# EAGLE design Swill REV A1 (EAGLE 7.3.0)
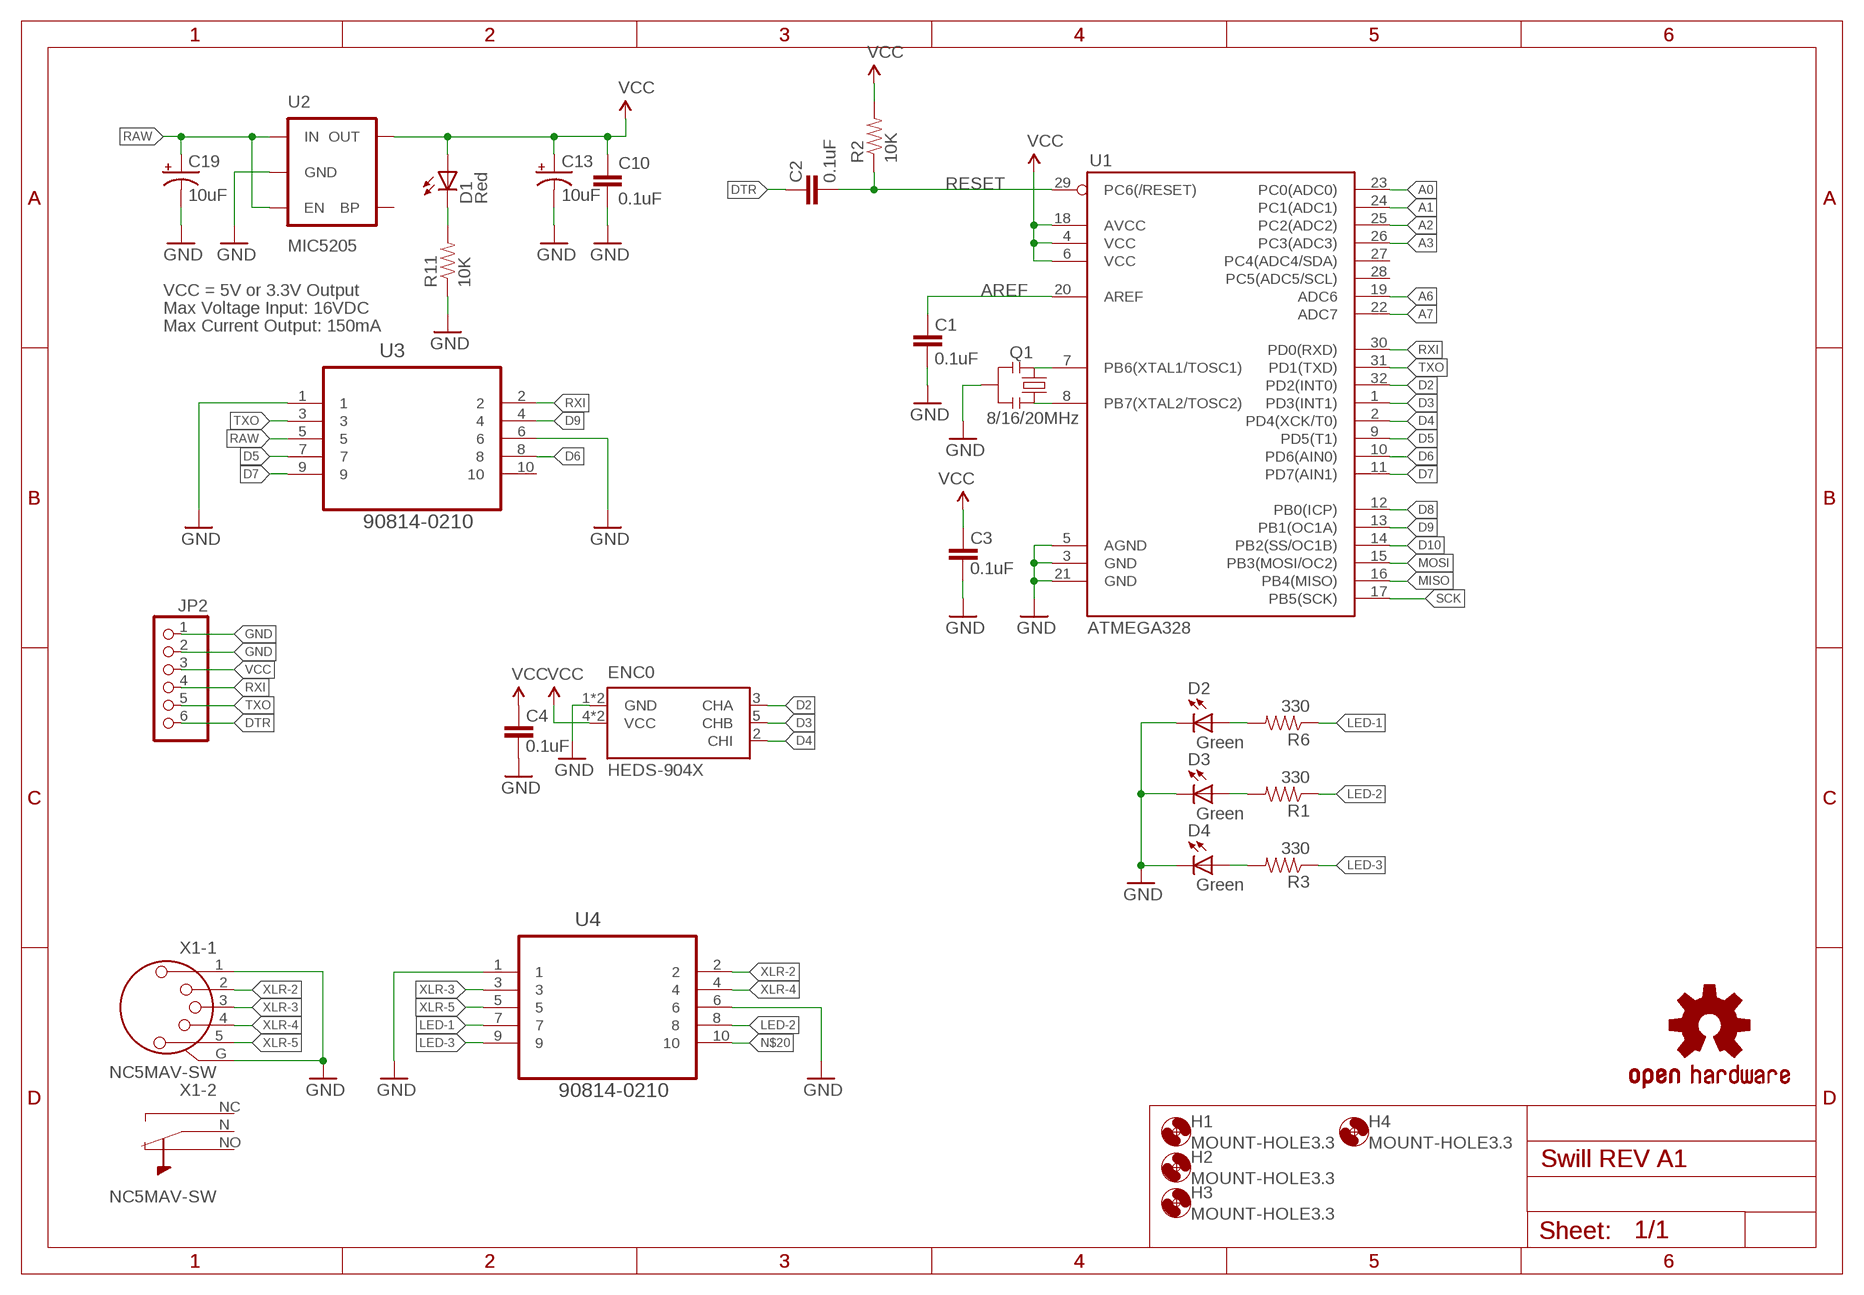
[diagram p0: schematic, sheet 1]

## Parts
C1  0.1uF  CAP0603-CAP  [0603-CAP]
C2  0.1uF  CAP0603-CAP  [0603-CAP]
C3  0.1uF  CAP0603-CAP  [0603-CAP]
C4  0.1uF  CAP0603-CAP  [0603-CAP]
C10  0.1uF  CAP0603-CAP  [0603-CAP]
C13  10uF  CAP_POL1206  [EIA3216]
C19  10uF  CAP_POL1206  [EIA3216]
D1  Red  LED  [0603-LED-ALT1]
D2  Green  LED  [0603-LED-ALT1]
D3  Green  LED  [0603-LED-ALT1]
D4  Green  LED  [0603-LED-ALT1]
ENC0  HEDS-904X  [HEDS-9041]
H1  MOUNT-HOLE3.3  [3,3]
H2  MOUNT-HOLE3.3  [3,3]
H3  MOUNT-HOLE3.3  [3,3]
H4  MOUNT-HOLE3.3  [3,3]
JP2  PINHD-1X6  [1X06]
Q1  8/16/20MHz  RESONATOR1:1  [RESONATOR-SMD-1:1]
R1  330  RESISTOR0603-RES  [0603-RES]
R2  10K  RESISTOR0603-RES  [0603-RES]
R3  330  RESISTOR0603-RES  [0603-RES]
R6  330  RESISTOR0603-RES  [0603-RES]
R11  10K  RESISTOR0603-RES  [0603-RES]
U1  ATMEGA328  ATMEGA168  [TQFP32-08]
U2  MIC5205  V_REG_LDOSMD  [SOT23-5]
U3  90814-0210  [MOLEX_90814-0210]
U4  90814-0210  [MOLEX_90814-0210]
U$3  OSHW-LOGOS  [OSHW-LOGO-S]
X1  NC5MAV-SW  [NC5MAV-SW]

## Nets
3.3V: C4.2 ; supply symbol labelled VCC
A0: U1.23(PC0(ADC0))
A1: U1.24(PC1(ADC1))
A2: U1.25(PC2(ADC2))
A3: U1.26(PC3(ADC3))
A6: U1.19(ADC6)
A7: U1.22(ADC7)
AREF: C1.2 U1.20(AREF)
D2: ENC0.3(CHA) U1.32(PD2(INT0))
D3: ENC0.5(CHB) U1.1(PD3(INT1))
D4: ENC0.2(CHI) U1.2(PD4(XCK/T0))
D5: U1.9(PD5(T1)) U3.7
D6: U1.10(PD6(AIN0)) U3.8
D7: U1.11(PD7(AIN1)) U3.9
D8: U1.12(PB0(ICP))
D9: U1.13(PB1(OC1A)) U3.4
D10: U1.14(PB2(SS/OC1B))
DTR: C2.2 JP2.6
GND [vcc]: C1.1 C3.1 C4.1 C10.2 C13.C(-) C19.C(-) D2.C D3.C D4.C ENC0.1(GND) ENC0.A(GND) JP2.1 JP2.2 Q1.2 R11.1 U1.3(GND) U1.5(AGND) U1.21(GND) U2.2(GND) U3.1 U3.6 U4.1 U4.6 X1.1 X1.G(-1:G)
LED-1: R6.1 U4.7
LED-2: R1.1 U4.8
LED-3: R3.1 U4.9
MISO: U1.16(PB4(MISO))
MOSI: U1.15(PB3(MOSI/OC2))
N$1: Q1.3 U1.8(PB7(XTAL2/TOSC2))
N$2: Q1.1 U1.7(PB6(XTAL1/TOSC1))
N$3: D3.A R1.2
N$4: D1.C R11.2
N$5: D4.A R3.2
N$7: D2.A R6.2
N$20: U4.10
RAW [vcc]: C19.A(+) U2.1(IN) U2.3(EN) U3.5
RESET: C2.1 R2.1 U1.29(PC6(/RESET))
RXI: JP2.4 U1.30(PD0(RXD)) U3.2
SCK: U1.17(PB5(SCK))
TXO: JP2.5 U1.31(PD1(TXD)) U3.3
VCC: C3.2 C10.1 C13.A(+) D1.A ENC0.4(VCC) ENC0.B(VCC) JP2.3 R2.2 U1.4(VCC) U1.6(VCC) U1.18(AVCC) U2.5(OUT)
XLR-2: U4.2 X1.2
XLR-3: U4.3 X1.3
XLR-4: U4.4 X1.4
XLR-5 [vcc]: U4.5 X1.5
Unconnected: U1.27(PC4(ADC4/SDA)) U1.28(PC5(ADC5/SCL)) U2.4(BP) U3.10 X1.N(-2:N) X1.NC(-2:NC) X1.NO(-2:NO)

## Notes on the sheet
- VCC = 5V or 3.3V Output
- Max Voltage Input: 16VDC
- Max Current Output: 150mA

## Library data of the parts
C1-C4 C10 = SparkFun:CAP: Capacitor Standard 0603 ceramic capacitor, and 0.1" leaded capacitor.; MF: MULTICOMP; MPN: MC0603F104Z160CT; OC_FARNELL: 1759017
C13 C19 = SparkFun:CAP_POL: Capacitor Polarized These are standard SMD and PTH capacitors. Normally 10uF, 47uF, and 100uF in electrolytic and tantalum varieties. Always verify the external diameter of the through hole cap, it varies with capacity, voltage, and manufacturer. The EIA devices should be standard.; MF: MULTICOMP; MPN: MCCTA106M006; OC_FARNELL: 1190107
D1 = Testing:LED: LEDs Standard schematic elements and footprints for 5mm, 3mm, 1206, and 0603 sized LEDs. 5mm - Spark Fun Electronics SKU : COM-00529 (and others); MF: MULTICOMP; MPN: MCL-S290SRC; OC_FARNELL: 1581244
D2-D4 = Testing:LED: LEDs Standard schematic elements and footprints for 5mm, 3mm, 1206, and 0603 sized LEDs. 5mm - Spark Fun Electronics SKU : COM-00529 (and others); MF: MULTICOMP; MPN: 703-0109; OC_FARNELL: 2112121
ENC0 = avango-encoders:HEDS-904X; MF: AVAGO TECHNOLOGIES; MPN: HEDS-9040#J00; OC_FARNELL: 1654869
H1-H4 = holes:MOUNT-HOLE: MOUNTING HOLE with drill center marker; OC_FARNELL: unknown
JP2 = pinhead:PINHD-1X6: PIN HEADER; MF: MULTICOMP; MPN: MC34751; OC_FARNELL: 1593430
Q1 = Testing:RESONATOR: Resonator Small SMD resonator. This is the itty bitty 10/20MHz resonators with built in caps. CSTCE10M0G55 and CSTCE20M0V53. Footprint for SMD has been used in SFE production for years, and does work okay. 1:1 is an attempt to get larger fillets on the sides so it will be easier to inspect these solders in our AOI machine. The pads have been minimized to match the actual metal under the resonator. To see this relation, it includes an image import of the bottom side of the component. Imported to scale on layer 200.; MF: MURATA; MPN: CSTCE8M00G55Z-R0; OC_FARNELL: 1615352
R1 R3 R6 = SparkFun:RESISTOR: Resistor Basic schematic elements and footprints for 0603, 1206, and PTH resistors.; MF: MULTICOMP; MPN: MCWR06X3300FTL; OC_FARNELL: 2447339
R2 R11 = SparkFun:RESISTOR: Resistor Basic schematic elements and footprints for 0603, 1206, and PTH resistors.; MF: MULTICOMP; MPN: MCHP03W8F1002T5E; OC_FARNELL: 1576297
U1 = SparkFun:ATMEGA168; MF: ATMEL; MPN: ATMEGA328-AUR; OC_FARNELL: 2443176
U2 = SparkFun:V_REG_LDO: Voltage Regulator LDO Standard 150mA LDO voltage regulator in SOT-23 layout. Micrel part MIC5205. BP (by-pass) pin is used to lower output noise with 470pF cap.; MF: MICREL SEMICONDUCTOR; MPN: MIC5205-3.0YM5 TR; OC_FARNELL: 2100318
U3 U4 = Molex_By_element14_Batch_1:90814-0210: CONN HEADER 10POS 1.27MM SMD TIN; MF: MOLEX; MPN: 90814-0210; OC_FARNELL: 1757026; OC_NEWARK: 34R6217; PACKAGE: CONN-10POS; SUPPLIER: Molex
U$3 = SparkFun:OSHW-LOGO: Open Source Hardware Logo This logo indicates the piece of hardware it is found on incorporates a OSHW license and/or adheres to the definition of open source hardware found here: http://freedomdefined.org/OSHW; OC_FARNELL: unknown
X1 = con-neutrik_ag:NC5?-SW: Neutrik Audio Connector XLR SERIES Stereo 1/4" jack Source: www.neutrik.com/; MF: NEUTRIK; MPN: NC5MAV-SW; OC_FARNELL: 1310098

## Net classes
0 default: width 0.203 mm
1 vcc: width 0.254 mm

## Board
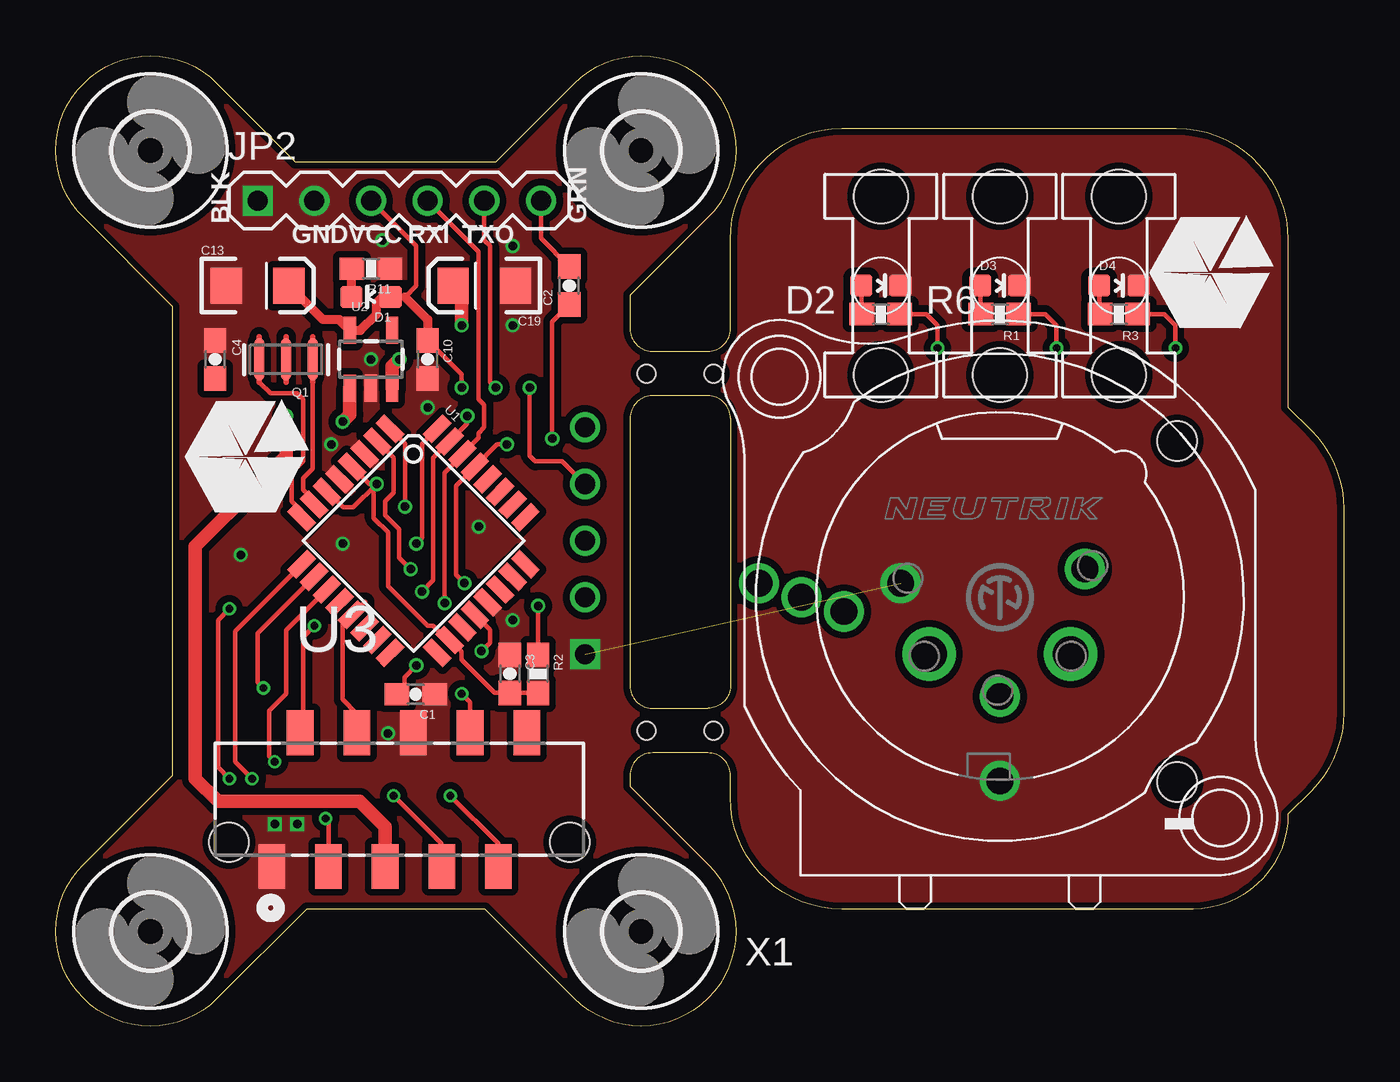
[diagram p1: board, top side]
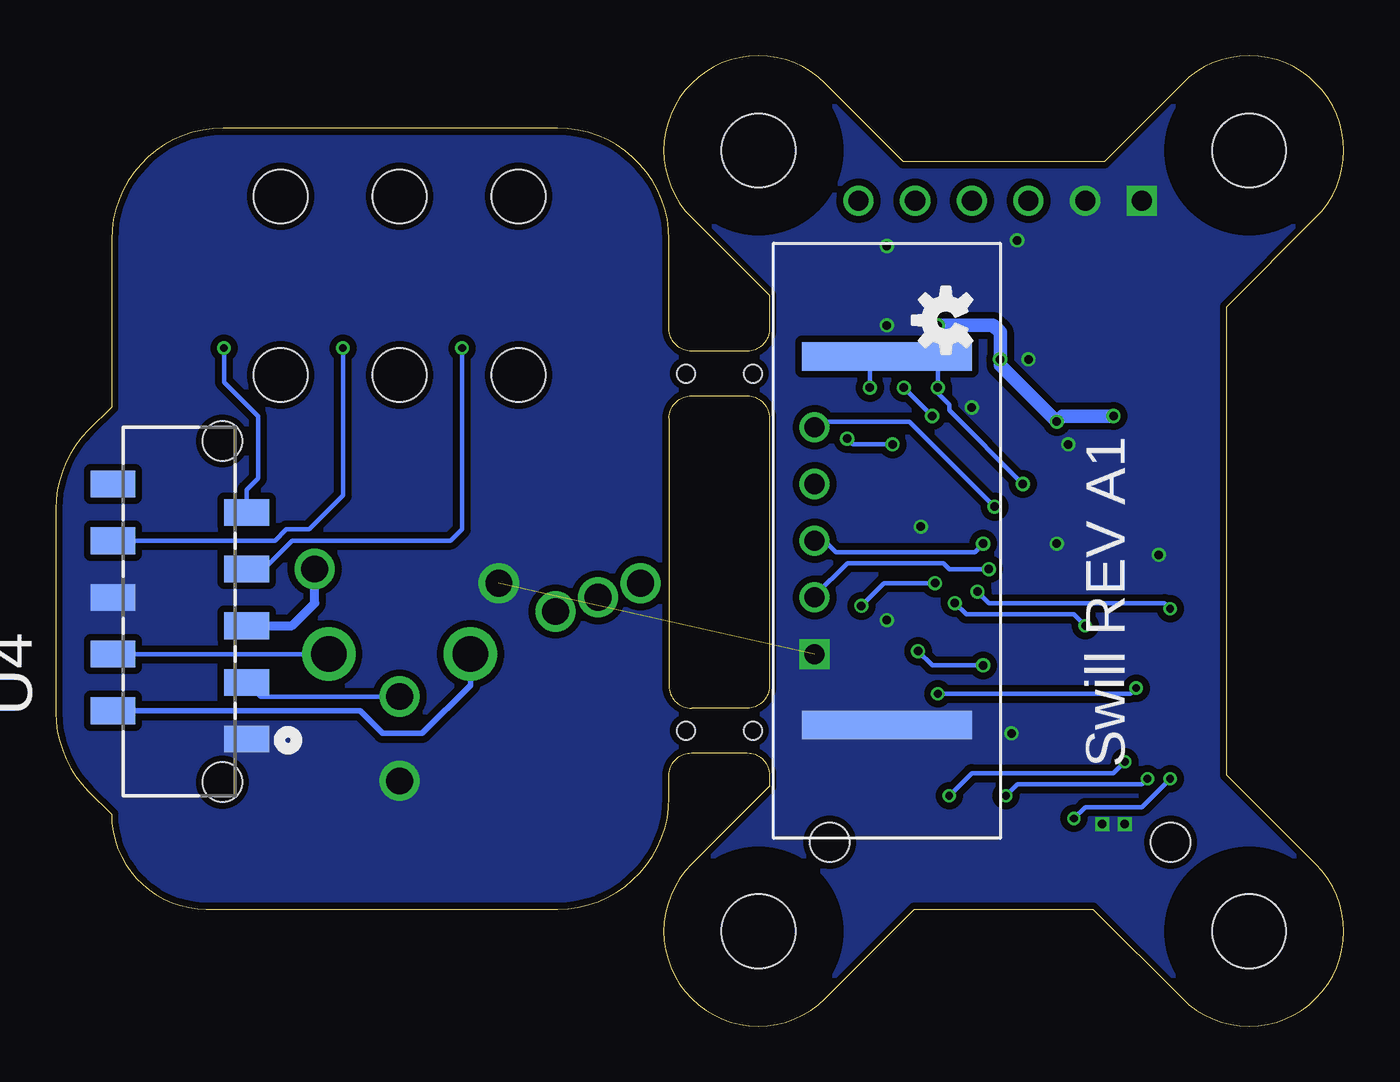
[diagram p2: board, bottom side, seen from below]

Size 57.74 x 43.49 mm. Coordinates in mm from the lower left corner, seen from the top.
Outline: 55.24,9.49 arc-90 50.99,5.24 35.24,5.24 arc-90 30.24,10.24 30.24,11.24 arc90 29.24,12.24 26.74,12.24 arc90 25.74,11.24 25.74,10.74 29.24,7.24 arc-180 23.24,1.24 19.24,5.24 11.24,5.24 7.24,1.24 arc-180 1.24,7.24 5.24,11.24 5.24,32.24 1.24,36.24 arc-180 7.24,42.24 10.74,38.74 19.74,38.74 23.24,42.24 arc-180 29.24,36.24 25.74,32.74 25.74,31.24 arc90 26.74,30.24 29.24,30.24 arc90 30.24,31.24 30.24,35.24 arc-90 35.24,40.24 50.24,40.24 arc-90 55.24,35.24 55.24,27.74 56.28,26.71 arc-45 57.74,23.17 57.74,14.06 arc-45 56.28,10.53 55.24,9.49
Outline: 30.24,27.24 30.24,15.24 arc-90 29.24,14.24 26.74,14.24 arc-90 25.74,15.24 25.74,27.24 arc-90 26.74,28.24 29.24,28.24 arc-90 30.24,27.24
Copper layers (1*16): Top 0.018mm / dielectric 1.55mm / Bottom 0.018mm
Design rules "eC_2Layer_PClass6_BaseCopperO18_eCDefault": minimum track width 0.15mm, minimum drill 0.35mm, track to track 0.15mm, track to pad 0.15mm, pad to pad 0.15mm, via to via 0.15mm, smd to smd 0mil, copper to edge 0.25mm, drill to drill 0.35mm, minimum pad ring 0.175mm, minimum via ring 0.125mm, stop-mask expansion 0mil, vias tented up to drill 0.45mm, thermal gap 0.2mm
Holes 0.8 mm at 26.49,29.24 29.49,29.24 29.49,13.24 26.49,13.24

### Footprints (pad centres in the part's own frame; a part is rotated, then mirrored left to right if it is on the bottom)
0603-CAP = smd 1.1 x 1: 1 -0.85,0; 2 0.85,0
EIA3216 = smd 1.4 x 1.6: A 1.4,0; C -1.4,0
0603-LED-ALT1 = smd 1 x 1: A 0,-0.877; C 0,0.877
HEDS-9041 = drill 0.9 square: 1 -5.08,3.239 | drill 0.9: 2 -2.54,3.239; 3 0,3.239; 4 2.54,3.239; 5 5.08,3.239 | smd 1.27 x 7.62: A -8.255,0; B 8.255,0
3,3 = hole 3.3: 0,0
1X06 = drill 0.9 square: 1 -6.35,0 | drill 0.9: 2 -3.81,0; 3 -1.27,0; 4 1.27,0; 5 3.81,0; 6 6.35,0
RESONATOR-SMD-1:1 = smd 0.45 x 1.905: 1 -1.2,0; 2 0,0; 3 1.2,0
0603-RES = smd 1.1 x 1: 1 -0.85,0; 2 0.85,0
TQFP32-08 = smd 1.27 x 0.559: 1 -4.293,2.8; 2 -4.293,2; 3 -4.293,1.2; 4 -4.293,0.4; 5 -4.293,-0.4; 6 -4.293,-1.2; 7 -4.293,-2; 8 -4.293,-2.8; 17 4.293,-2.8; 18 4.293,-2; 19 4.293,-1.2; 20 4.293,-0.4; 21 4.293,0.4; 22 4.293,1.2; 23 4.293,2; 24 4.293,2.8 | smd 0.559 x 1.27: 9 -2.8,-4.293; 10 -2,-4.293; 11 -1.2,-4.293; 12 -0.4,-4.293; 13 0.4,-4.293; 14 1.2,-4.293; 15 2,-4.293; 16 2.8,-4.293; 25 2.8,4.293; 26 2,4.293; 27 1.2,4.293; 28 0.4,4.293; 29 -0.4,4.293; 30 -1.2,4.293; 31 -2,4.293; 32 -2.8,4.293
SOT23-5 = smd 0.55 x 1.2: 1 -0.95,-1.3; 2 0,-1.3; 3 0.95,-1.3; 4 0.95,1.3; 5 -0.95,1.3
MOLEX_90814-0210 = smd 1.194 x 2.007: 1 0,0; 2 1.27,5.994; 3 2.54,0; 4 3.81,5.994; 5 5.08,0; 6 6.35,5.994; 7 7.62,0; 8 8.89,5.994; 9 10.16,0; 10 11.43,5.994 | hole 1.753: -1.93,1.092; 13.36,1.092
1275.100 = hole 2.4: 4,0; -4,0
NC5MAV-SW = drill 1.2: 1 -4.445,0.635; 3 0,-4.445; 5 3.81,1.27; G 0,-8.225; N -8.89,0; NC -6.985,-0.635; NO -10.795,0.635 | drill 1.6: 2 -3.175,-2.54; 4 3.175,-2.54

### Placement (x,y rotation side)
C1  16.14,14.87 180 top
C2  23.02,33.18 90 top
C3  20.36,15.78 270 top
C4  7.15,29.88 270 top
C10  16.67,29.88 270 top
C13  9.05,33.18 0 top
C19  19.21,33.18 180 top
D1  14.13,32.67 90 top
D2  36.99,33.18 270 top
D3  42.33,33.18 270 top
D4  47.66,33.18 270 top
E$1  [EXM-LOGO]  51.74,33.74 0 top
E$2  [EXM-LOGO]  8.49,25.49 0 top
ENC0  20.48,21.75 90 bottom
H1  4.24,4.24 0 top
H2  4.24,39.24 0 top
H3  26.24,4.24 0 top
H4  26.24,39.24 0 top
JP2  15.4,36.99 0 top
Q1  10.32,29.88 180 top
R1  42.33,31.91 180 top
R2  21.63,15.78 270 top
R3  47.66,31.91 180 top
R6  36.99,31.91 180 top
R11  14.13,33.94 180 top
U1  16.04,21.75 315 top
U2  14.13,29.88 0 top
U3  9.69,7.15 0 top
U4  49.18,12.86 90 bottom
U$3  17.84,31.63 90 bottom
U$4  [1275.100]  42.33,33.18 90 top
U$5  [1275.100]  47.66,33.18 90 top
U$6  [1275.100]  36.99,33.18 90 top
X1  42.33,19.21 0 top

### Tracks (layer width: path | path; a pad name or v marks a point on that pad's centre or on a via)
AREF  (via drill 0.38)
  Top 0.203: U1.20 19.47,17.76 19.47,17.18 v19.09,16.8 | v16.16,16.16 15.63,15.63 15.63,14.96 C1.2
  Bottom 0.203: v19.09,16.8 18.45,16.16 v16.16,16.16
D2  (via drill 0.38)
  Top 0.203: U1.32 16.42,26.09 16.42,21.88 v16.16,21.63
  Bottom 0.203: v16.16,21.63 16.55,21.24 22.77,21.24 23.28,21.75 ENC0.3
D3  (via drill 0.38)
  Top 0.203: U1.1 15.66,26.09 v15.66,23.28
  Bottom 0.203: v15.66,23.28 19.47,27.09 23.47,27.09 ENC0.5
D4  (via drill 0.38)
  Top 0.203: U1.2 15.15,25.47 15.15,23.91 14.77,23.53 14.77,22.9 15.4,22.26 15.4,20.99 v15.91,20.48
  Bottom 0.203: v15.91,20.48 17.69,20.48 17.94,20.74 22.26,20.74 23.72,19.28 ENC0.2
D5  (via drill 0.35)
  Top 0.203: U3.7 17.31,8.16 v15.15,10.32 | v8.8,11.08 8.04,11.85 8.04,17.69 11.02,20.67 U1.9
  Bottom 0.203: v15.15,10.32 14.64,10.83 9.05,10.83 v8.8,11.08
D6  (via drill 0.35)
  Top 0.203: U1.10 9.05,17.6 9.05,15.4 v9.31,15.15 | U3.8 18.58,14.51 v18.2,14.89
  Bottom 0.203: v18.2,14.89 9.56,14.89 v9.31,15.15
D7  (via drill 0.35)
  Top 0.203: U1.11 10.32,17.73 10.32,14.89 9.56,14.13 9.56,12.1 v9.81,11.85 | U3.9 19.85,8.16 v17.69,10.32
  Bottom 0.203: v17.69,10.32 16.67,11.34 10.32,11.34 v9.81,11.85
D9
  Top 0.203: 13.88,19.03 U1.13 12.86,18.01 12.86,14.64 13.5,14.01 U3.4
DTR
  Top 0.203: C2.2 21.75,35.3 JP2.6
GND  (via drill 0.38)  (1 unrouted)
  other vias: 14.13,29.88 12.35,26.07 16.67,27.72 20.48,18.2 20.48,34.96 14.64,35.21 20.48,31.4 10.83,9.05 9.81,9.05 18.96,22.39 12.86,21.63 8.29,21.12 14.89,13.12
  pour Top (isolate 0.305, no thermals): 0.24,45.24 65.24,45.24 65.24,0.24 0.24,0.24
  pour Bottom (isolate 0.305, no thermals): 0.24,45.24 65.24,45.24 65.24,0.24 0.24,0.24
LED-1  (via drill 0.35)
  Top 0.203: v39.53,30.39 39.53,31.4 39.02,31.91 R6.1
  Bottom 0.203: U4.7 48.42,20.48 47.15,21.75 40.04,21.75 39.53,22.26 v39.53,30.39
LED-2  (via drill 0.35)
  Top 0.203: v44.87,30.39 44.87,31.4 44.36,31.91 R1.1
  Bottom 0.203: U4.8 47.91,21.75 47.41,22.26 46.39,22.26 44.87,23.78 v44.87,30.39
LED-3  (via drill 0.35)
  Top 0.203: v50.2,30.39 50.2,31.4 49.69,31.91 R3.1
  Bottom 0.203: U4.9 49.18,24.04 48.68,24.55 48.68,27.34 50.2,28.86 v50.2,30.39
N$1
  Top 0.203: 9.12,28.86 9.63,28.36 10.83,28.36 11.08,28.1 11.08,25.31 10.58,24.8 10.58,23.53 11.02,23.08 U1.8
N$2
  Top 0.203: 11.52,28.86 11.52,24.98 11.08,24.55 11.08,24.04 11.59,23.54 U1.7
N$3
  Top 0.203: D3.A 41.45,31.94 R1.2
N$4
  Top 0.203: R11.2 13.26,33.92 13.26,33.69
  Top 0.406: D1.C 13.26,33.69 13.26,33.79
N$5
  Top 0.203: D4.A 46.78,31.94 R3.2
N$7
  Top 0.203: D2.A 36.12,31.94 R6.2
RAW  (via drill 0.38)
  Top 0.406: C19.A 18.2,32.8
  Top 0.61: 18.2,32.8 v18.2,31.4 | v15.4,29.88 15.08,29.56 U2.3 | v10.32,27.34 10.32,25.56 9.05,24.29 6.26,21.5 6.26,11.08 7.27,10.07 13.62,10.07 14.77,8.93 U3.5 | v12.86,27.09 13.18,27.41 U2.1
  Bottom 0.406: 15.4,29.63 v15.4,29.88
  Bottom 0.61: v18.2,31.4 15.72,31.4 15.4,31.09 v15.4,29.88 | v10.32,27.34 12.61,27.34 v12.86,27.09 15.4,29.63
RESET  (via drill 0.38)
  Top 0.203: C2.1 22.26,31.57 v22.26,26.32 | v20.23,26.07 19.79,26.07 U1.29 17.94,24.22 17.94,20.23 v18.32,19.85 | v21.63,18.83 R2.1
  Bottom 0.203: v22.26,26.32 22.01,26.07 v20.23,26.07 | v18.32,19.85 20.61,19.85 v21.63,18.83
RXI  (via drill 0.35, 0.38)
  Top 0.203: v17.43,18.96 17.43,24.8 18.22,25.59 U1.30 18.96,26.37 18.96,26.58 19.21,26.83 19.21,27.85 18.96,28.1 18.96,34.71 JP2.4 | v11.59,17.94 11.08,17.43 11.08,13.27 U3.2
  Bottom 0.203: v17.43,18.96 16.93,18.45 12.1,18.45 v11.59,17.94
TXO  (via drill 0.35, 0.38)
  Top 0.203: v19.72,28.61 19.47,28.86 19.47,34.96 19.21,35.21 JP2.5 | v16.42,19.47 16.93,19.97 16.93,25.47 U1.31 18.45,26.99 v18.45,27.34 | v7.78,18.7 7.27,18.2 7.27,11.59 v7.78,11.08 | v12.1,9.31 12.23,9.18 U3.3
  Bottom 0.203: v19.72,28.61 v18.45,27.34 | v16.42,19.47 15.91,18.96 8.04,18.96 v7.78,18.7 | v7.78,11.08 9.05,9.81 11.59,9.81 v12.1,9.31
VCC  (via drill 0.38)
  Top 0.203: R2.2 C3.2 19.68,14.93 18.2,16.42 18.2,16.77 U1.18 17.57,17.3 16.93,17.94 16.67,17.94 14.89,19.72 14.89,22.13 14.26,22.77 14.26,24.17 v14.39,24.29 | D1.A 15.66,32.67 16.16,33.18 16.16,34.96 JP2.3 | ENC0.4 22.7,25.31 21.5,25.31 21.24,25.56 v21.24,28.61 | C10.1 18.2,29.21 v18.2,28.61 | U1.4 14.06,24.29 v14.39,24.29 | U1.6 12.2,23.94 12.89,23.25 13.34,23.25 v14.39,24.29
  Top 0.406: C13.A 11.98,31.66 12.7,31.66 U2.5 13.65,31.18 14.39,31.91 14.39,32.42 14.64,32.67 D1.A | 15.66,32.67 16.67,31.66 C10.1
  Bottom 0.203: v21.24,28.61 21.24,29.88 21.12,30.01 ENC0.B 18.32,30.01 18.2,29.88 v18.2,28.61 18.2,28.36 17.69,27.85 17.69,27.59 v14.39,24.29
XLR-2
  Bottom 0.254: U4.2 44.1,14.13 43.09,13.12 41.31,13.12 39.15,15.28 X1.2
XLR-3
  Bottom 0.203: U4.3 48.55,14.77 X1.3
XLR-4
  Bottom 0.203: U4.4 X1.4
XLR-5
  Bottom 0.406: U4.5 47.15,17.94 46.14,18.96 X1.5

### Text on the board
tPlace: BLK | GRN | GND | VCC | RXI | TXO
bPlace: Swill REV A1
tValues: Valid combinations: | 168V / 3.3V Reg / 8MHz | 168 / 5V Reg / 16MHz | 168 / 5V Reg / 20MHz | Mark back accordingly | Arduino Pro Mini
Document: Swill REV A1 | Released under the Creative Commons Attribution Share-Alike 3.0 License / http://creativecommons.org/licenses/by-sa/3.0 / Inspired from Arduino Pro Mini design / Designed by Benoit Rapidel - ExMachina